# Altium schematic sheet Communication.SchDoc
size A; SheetNumber: 3; SheetTotal: 9
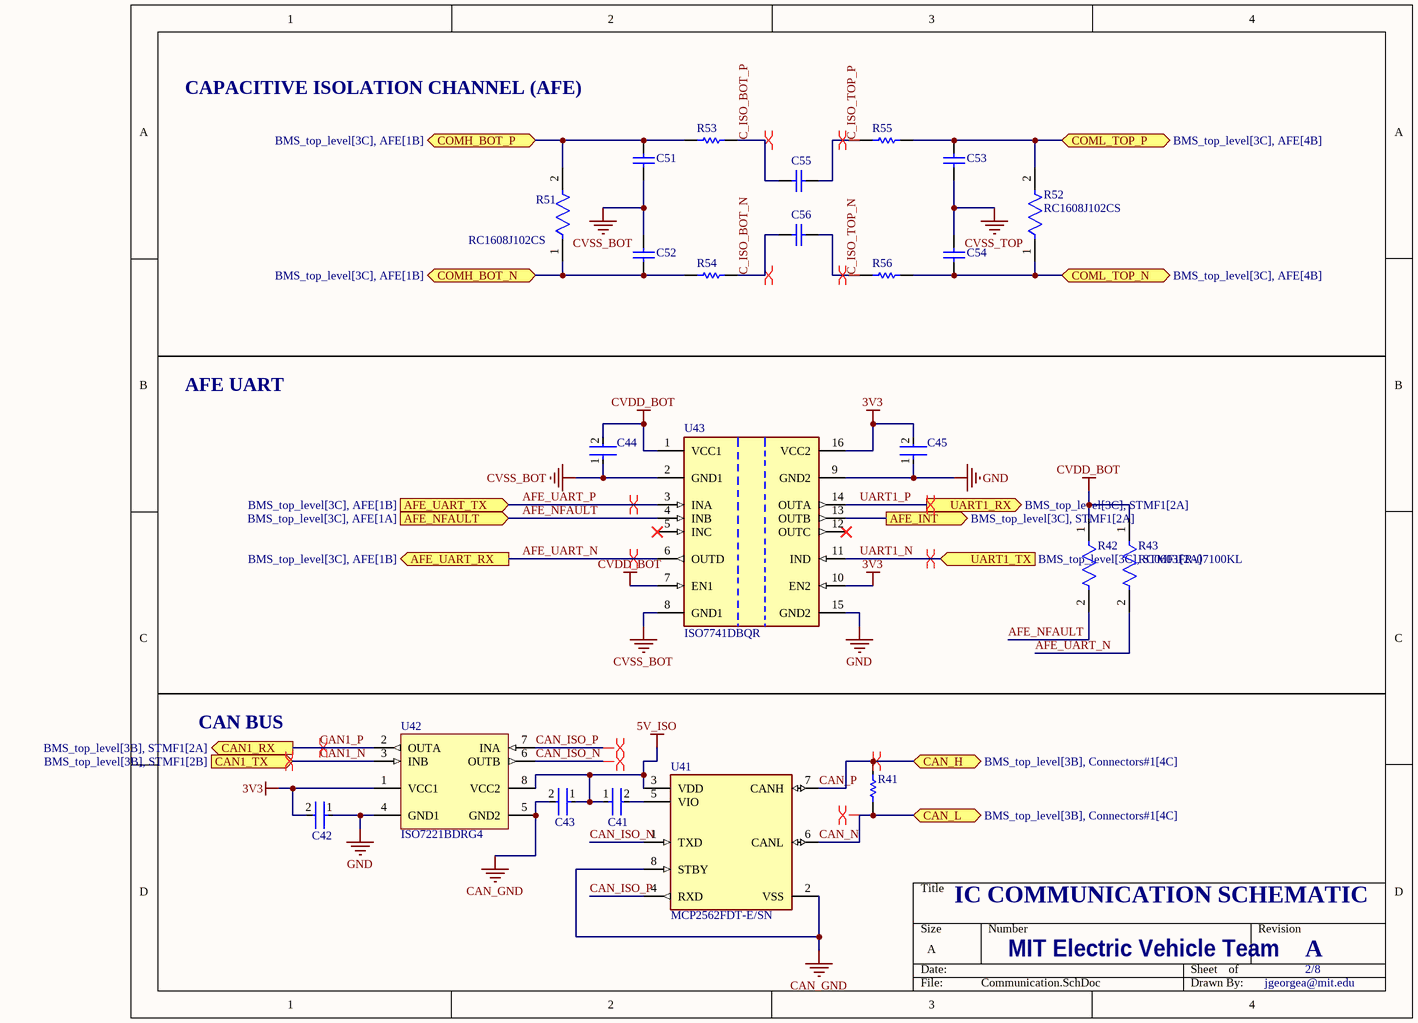
[diagram p0: Communication.SchDoc]

## Parts
C41  CGA3E2X7R1H104K080AA  [FP-CGA3E-0_3-0_1-IPC_A]  (value not drawn)
C42  CGA3E2X7R1H104K080AA  [FP-CGA3E-0_3-0_1-IPC_A]  (value not drawn)
C43  CGA3E2X7R1H104K080AA  [FP-CGA3E-0_3-0_1-IPC_A]  (value not drawn)
C44  CGA3E2X7R1H104K080AA  [FP-CGA3E-0_3-0_1-IPC_A]  (value not drawn)
C45  CGA3E2X7R1H104K080AA  [FP-CGA3E-0_3-0_1-IPC_A]  (value not drawn)
C51  06031C221KAT2A  [CAPC1608X90X35ML15T15]  (value not drawn)
C52  06031C221KAT2A  [CAPC1608X90X35ML15T15]  (value not drawn)
C53  06031C221KAT2A  [CAPC1608X90X35ML15T15]  (value not drawn)
C54  06031C221KAT2A  [CAPC1608X90X35ML15T15]  (value not drawn)
C55  08051C222JAT2A  [CAPC2013X94X50LL20T25]  (value not drawn)
C56  08051C222JAT2A  [CAPC2013X94X50LL20T25]  (value not drawn)
R41  ERJ-3EKF1200V  [RESC1609X55X30ML15T15]  (value not drawn)
R42  RC0603FR-07100KL  [FP-RC0603-0_55-MFG]  (value not drawn)
R43  RC0603FR-07100KL  [FP-RC0603-0_55-MFG]
R51  RC1608J102CS  [FP-RC1608-IPC_A]
R52  RC1608J102CS  [FP-RC1608-IPC_A]
R53  48R7 1% 0603(1608)  [RESC0603(1608)_M]  (value not drawn)
R54  48R7 1% 0603(1608)  [RESC0603(1608)_M]  (value not drawn)
R55  48R7 1% 0603(1608)  [RESC0603(1608)_M]  (value not drawn)
R56  48R7 1% 0603(1608)  [RESC0603(1608)_M]  (value not drawn)
U41  MCP2562FDT-E/SN  [FP-C04-057-SN-MFG]
U42  ISO7221BDRG4  [D0008B_M]
U43  ISO7741DBQR  [FP-DBQ0016A-MFG]

## Ports
AFE_INT (out, see BMS_top_level[3C], STMF1[2A]), AFE_NFAULT (in, see BMS_top_level[3C], AFE[1A]), AFE_UART_RX (out, see BMS_top_level[3C], AFE[1B]), AFE_UART_TX (in, see BMS_top_level[3C], AFE[1B]), CAN1_RX (out, see BMS_top_level[3B], STMF1[2A]), CAN1_TX (in, see BMS_top_level[3B], STMF1[2B]), CAN_H (bidir, see BMS_top_level[3B], Connectors#1[4C]), CAN_L (bidir, see BMS_top_level[3B], Connectors#1[4C]), COMH_BOT_N (bidir, see BMS_top_level[3C], AFE[1B]), COMH_BOT_P (bidir, see BMS_top_level[3C], AFE[1B]), COML_TOP_N (bidir, see BMS_top_level[3C], AFE[4B]), COML_TOP_P (bidir, see BMS_top_level[3C], AFE[4B]), UART1_RX (out, see BMS_top_level[3C], STMF1[2A]), UART1_TX (in, see BMS_top_level[3C], STMF1[2A])

## Nets
3V3: C42.2 C45.2 U42.1(VCC1) U43.10(EN2) U43.16(VCC2)
5V_ISO: C41.1 C43.1 U41.3(VDD) U42.8(VCC2)
CAN_GND: C43.2 U41.2(VSS) U41.8(STBY) U42.5(GND2)
CVDD_BOT: C44.2 R42.1 R43.1 U43.1(VCC1) U43.7(EN1)
CVSS_BOT: C44.1 C51.1 C52.1 U43.2(GND1) U43.8(GND1)
CVSS_TOP: C53.1 C54.1
GND: C42.1 C45.1 U42.4(GND1) U43.9(GND2) U43.15(GND2)
AFE_INT: U43.13(OUTB) ; port AFE_INT
AFE_NFAULT: R42.2 U43.4(INB) ; port AFE_NFAULT
AFE_UART_N: R43.2 U43.6(OUTD) ; port AFE_UART_RX
AFE_UART_P: U43.3(INA) ; port AFE_UART_TX
C_ISO_BOT_N: C56.1 R54.2
C_ISO_BOT_P: C55.1 R53.2
C_ISO_TOP_N: C56.2 R56.1
C_ISO_TOP_P: C55.2 R55.1
CAN1_N: U42.3(INB) ; port CAN1_TX
CAN1_P: U42.2(OUTA) ; port CAN1_RX
CAN_ISO_N: U41.1(TXD) U42.6(OUTB)
CAN_ISO_P: U41.4(RXD) U42.7(INA)
CAN_N: R41.1 U41.6(CANL) ; port CAN_L
CAN_P: R41.2 U41.7(CANH) ; port CAN_H
COMH_BOT_N: C52.2 R51.1 R54.1 ; port COMH_BOT_N
COMH_BOT_P: C51.2 R51.2 R53.1 ; port COMH_BOT_P
COML_TOP_N: C54.2 R52.1 R56.2 ; port COML_TOP_N
COML_TOP_P: C53.2 R52.2 R55.2 ; port COML_TOP_P
UART1_N: U43.11(IND) ; port UART1_TX
UART1_P: U43.14(OUTA) ; port UART1_RX
NetC41_2: C41.2 U41.5(VIO)

Not connected (* = marked no-connect by the designer): U43 5(INC)* 12(OUTC)*

## Layout directives
differential pair: AFE_UART_N, AFE_UART_P, C_ISO_BOT_N, C_ISO_BOT_P, C_ISO_TOP_N, C_ISO_TOP_P, CAN1_N, CAN1_P, CAN_ISO_N, CAN_ISO_P, CAN_N, CAN_P, UART1_N, UART1_P

## Notes on the sheet
- CAPACITIVE ISOLATION CHANNEL (AFE)
- AFE UART
- CAN BUS
- IC COMMUNICATION SCHEMATIC
- MIT Electric Vehicle Team
- 2/8
- A
- jgeorgea@mit.edu

## Library data of the parts
C41-C45 = CMP-2000-07546-2: Cap Ceramic 100nF 50V X7R 10% Pad SMD 0603 +125°C Automotive T/R; Weight: 7.1E-05oz; Composition: Ceramic; Max Operating Temperature: 125°C; Termination: SMD/SMT; Dielectric: X7R; Length: 1.6mm; Package Quantity: 1; REACH SVHC: No SVHC; Lead Free: Lead Free; Case Code (Metric): 1608; Min Operating Temperature: -55°C; Packaging: Tape and Reel; Tolerance: 10%; Voltage Rating: 50V; Case Code (Imperial): 0603; Capacitance: 100nF; Case/Package: 0603; Voltage Rating (DC): 50V; Depth: 0.8mm; Radiation Hardening: No; Ratings: AEC-Q200; Mount: Surface Mount; Voltage: 50V; Thickness: 0.035inch; Width: 0.8mm; Height: 0.8mm
C51-C54 = CMP-2006-04084-1: Manufacturer: AVX Interconnect / Elco; Part Number: 06031C221KAT2A
C55 C56 = CMP-2007-04184-1: Manufacturer: AVX Interconnect / Elco; Part Number: 08051C222JAT2A
R41 = CMP-2000-00213-2: Chip Resistor, 120 Ohm, +/- 1%, 0.1 W, -55 to 155 degC, 0603 (1608 Metric), RoHS, Tape and Reel; Manufacturer: Panasonic; Power Rating: 100mW; Voltage Rating (DC): 75V; Resistance: 120Ohm; Temperature Coefficient: 100ppm/degreesC; Number of Terminations: 2; Military Standard: Not; Tolerance: 1%; Min Operating Temperature: -55degC; Packaging: TapeandReel; Lead Free: LeadFree; Max Operating Temperature: 155degC; Manufacturer URL: http://www.panasonic.com/; Case Code (Imperial): 0603; REACH SVHC: NoSVHC; Width: 0.031inch; Datasheet URL: https://industrial.panasonic.com/cdbs/www-data/pdf/RDA0000/AOA0000C283.pdf; RoHSCompliant: true; Max Power Dissipation: 100mW; Termination: SMD/SMT; Package Reference: 0603; Height: 0.022inch; Depth: 0.8mm; Package Description: 2-Pin Surface Mount Device, Body 1.6 x 0.85 mm; Contact Plating: Tin; Length: 1.6mm; Package URL: http://www.st.com/st-web-ui/static/active/en/resource/technical/document/datasheet/CD00001320.pdf; Radiation Hardening: No; Package Quantity: 1; Number of Pins: 2; Datasheet Version: 42095.0; Voltage Rating: 75V; Composition: ThickFilm; Case/Package: 0603; Mount: SurfaceMount; Case Code (Metric): 1608
R42 R43 = CMP-2100-03662-2: RES SMD 100K OHM 1% 1/10W 0603; Voltage Rating (DC): 50V; Resistance: 100kR; Max Power Dissipation: 100mW; Temperature Coefficient: 100ppm/°C; Working Voltage: 75V; Length: 1.6mm; Lead Free: Lead Free; Number of Terminations: 2; Packaging: Tape and Reel; Voltage Rating: 50V; Termination: SMD/SMT; Width: 0.8mm; Resistor Type: Thick Film; Resistance Tolerance: 1%; Features: Moisture Resistant; Height: 0.45mm; Construction: Rectangular; Case/Package: 0603; Military Standard: Not; Case Code (Imperial): 0603; Series: RC; Technology: THICK FILM; Depth: 0.8mm; RoHS Compliant: Yes; REACH SVHC: No SVHC; Min Operating Temperature: -55°C; Case Code (Metric): 1608; Max Operating Temperature: 155°C; Power Rating: 100mW; Number of Pins: 2; Tolerance: 1%
R51 R52 = CMP-13261-002301-1: Res Thick Film 0603 1kΩ 5% 0.1W ±100ppm/°C Molded SMD T/R; Power Rating: 100mW; Resistance: 1kR; Voltage Rating (DC): 50V; Contact Plating: Tin; Mount: Surface Mount; Number of Terminations: 2; Features: Moisture Resistant; Max Power Dissipation: 100mW; Military Standard: Not; Case/Package: 0603; Radiation Hardening: No; Temperature Coefficient: 100ppm/°C; Length: 1.6mm; Height: 0.022inch; Case Code (Metric): 1608; Max Operating Temperature: 155°C; Composition: Thick Film; Tolerance: 5%; Width: 0.031inch; Depth: 0.8mm; Packaging: Tape and Reel; Lead Free: Lead Free; Case Code (Imperial): 0603; Min Operating Temperature: -55°C
R53-R56 = CMP-1012-00362-1: 48R7 0.1W 1% 0603 (1608 Metric)  SMD; Case-Metric: 1608; Case-EIA: 0603; Value: 48.70 Ohm; Power: 0.1 W; Tolerance: 1 %; Technology: SMT
U41 = CMP-06279-000005-1: IC TRANSCEIVER 1/1 8SOIC; Operating Supply Current: 70mA; Data Rate: 8Mbps; Number of Transceivers: 1; Receiver Hysteresis: 200mV; Max Supply Voltage: 5.5V; Min Supply Voltage: 4.5V; Weight: 0.019048oz; Package Quantity: 3300; Case/Package: SOIC; Mount: Surface Mount; Max Operating Temperature: 125°C; Min Operating Temperature: -40°C; Packaging: Tape and Reel; Number of Pins: 8
U42 = CMP-0328-00081-3: 5 Mbps Dual Channels, 1 / 1, Digital Isolator, 3.3 V / 5 V, -40 to +125 degC, 8-pin SOIC (D), Green (RoHS & no Sb/Br); Manufacturer: Texas Instruments; TTL/CMOS Input Threshold: TTL; Input Noise Filter: Yes; Datarate(Mbps): 5; Insulation Rating(VRMS): 2500; Rating: Catalog; Supply Voltage(s)(V): 3.3, 5; Eco-Plan: Green (RoHS & no Sb/Br); SubFamily: Isolator; PackageReference: D0008B; ComponentLink3URL: SamplesURL:http://www.ti.com/product/iso7221b#samples; ComponentLink1URL: http://www.ti.com/; ComponentLink2Description: Datasheet; Mounting Technology: Surface Mount; ComponentLink1Description: Manufacturer URL; Channel Configuration: 02/01/2000; PartNumber: ISO7221BDRG4; PackageVersion: revM, Jun-2011; ComponentLink2URL: http://www.ti.com/general/docs/lit/getliterature.tsp?genericPartNumber=ISO7221B&fileType=pdf; DatasheetVersion: SLLS755L; Thermal Shutdown: No; PackageDescription: 8-Pin Plastic Small Outline Integrated Circuit, 4.9 x 3.9 mm, Pitch 1.27 mm Pitch; ComponentLink3Description: URL Link1
U43 = CMP-04872-000008-1: Manufacturer: Texas Instruments; Nominal Supply Current: 0.8-18mA; Standoff Height: 0.11mm; Interface: SPI; Max Supply Voltage: 5.5V; Min Supply Voltage: 2.25V; Max Junction Temp: +150°C; Automotive: No; Ambient Temperature Range High: +125°C; Height: 1.75mm; Octopart: https://octopart.com/iso7741dbqr-texas+instruments-82338409; Temperature Range High: +125°C; Device Class L1: Integrated Circuits (ICs); Lead Free: Yes; Ambient Temperature Range Low: -55°C; Digikey Description: ISO7741DBQR; Package: DBQ0016A; Temperature: -55°C to +125°C; ComponentLink2URL: http://www.ti.com/lit/ds/symlink/iso7741.pdf; Category: IC; Manufacturer Part Number: ISO7741DBQR; Device Class L2: Interface ICs; Mouser Description: High-speed, low-power, robust EMC quad-channel digital isolator 16-SSOP -55 to 125; ComponentLink2Description: Datasheet; Temperature Range Low: -55°C; Device Class L3: unset; RoHS: TRUE